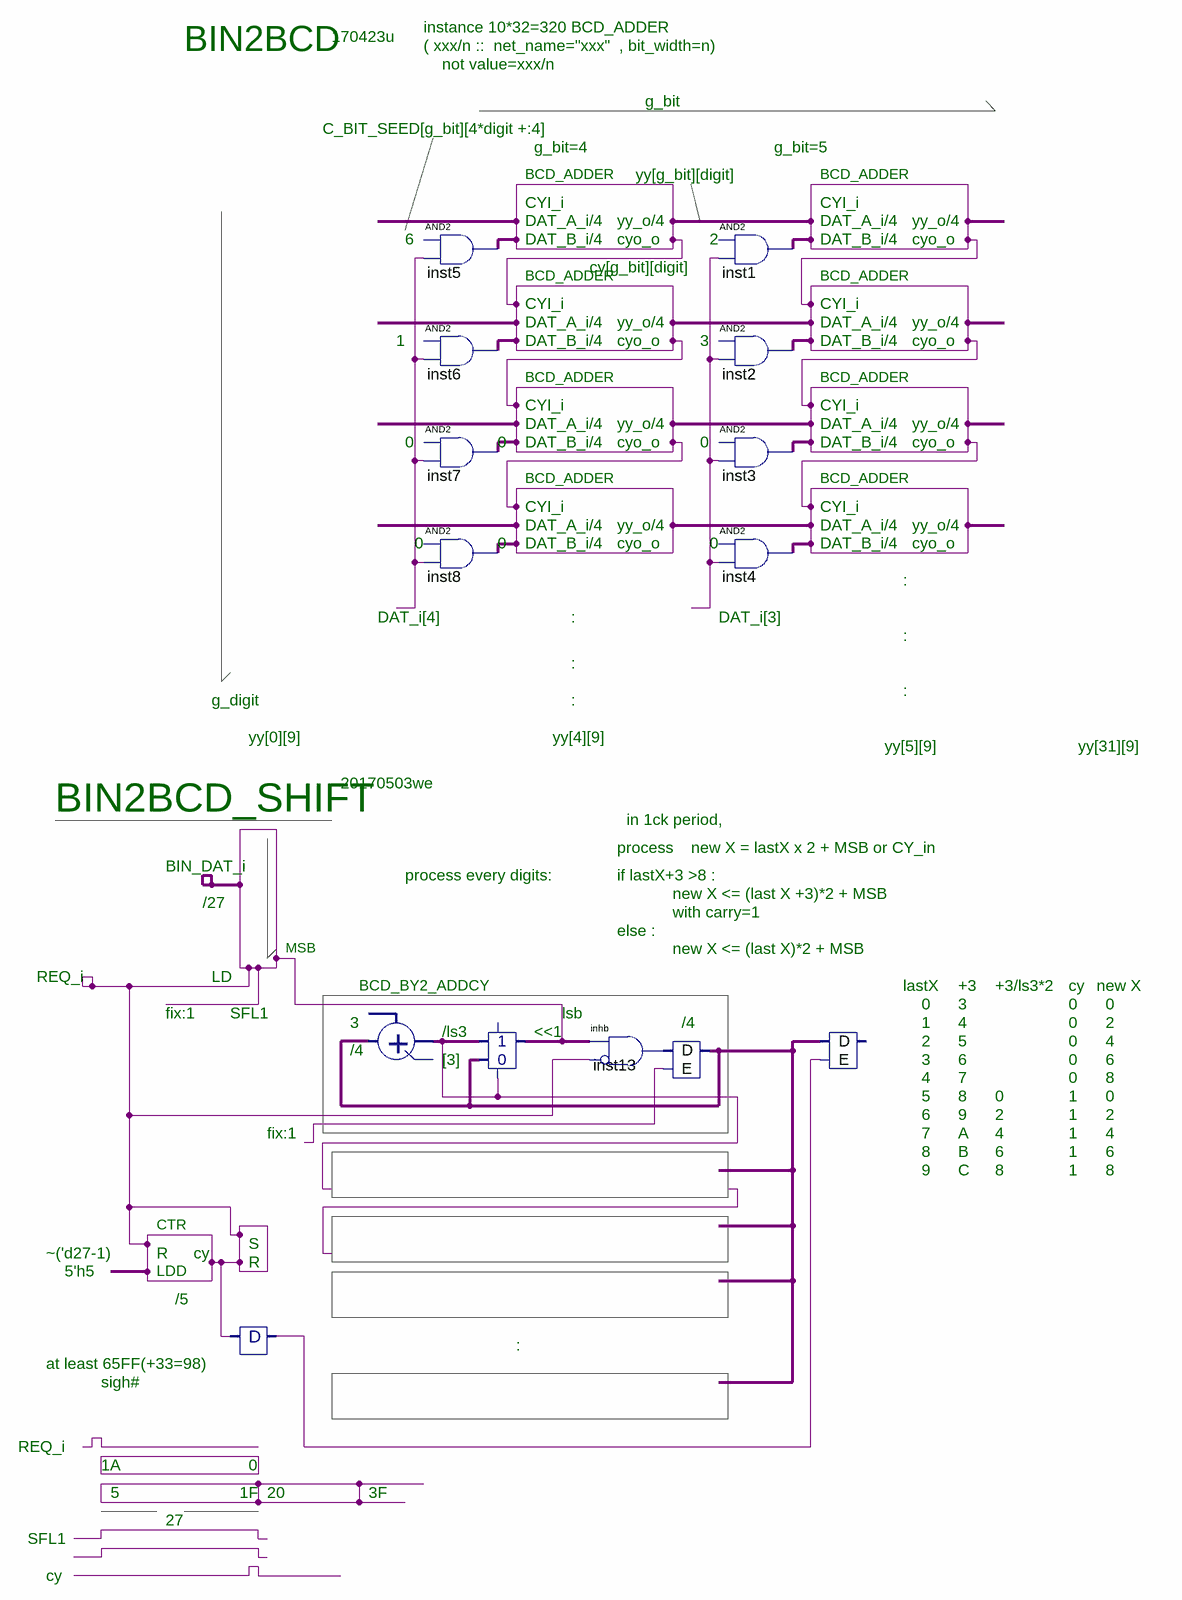
[diagram p0: schematic sheet]
// Quartus schematic BIN2BCD.bdf as structural Verilog: 14 symbols, 0 pins
module BIN2BCD (
);

  wire inst5_out, inst13_1, inst17_y, inst_y, undriven, undriven_2, undriven_3, undriven_4;
  wire [7:0] inst11_y, inst12_y;

  D inst17 (.A({8{inst_y}}), .Y(inst17_y));
  buf inst5 (inst5_out, undriven);  // AND2 open: IN1
  buf inst6 (inst5_out, undriven);  // AND2 open: IN1
  buf inst7 (inst5_out, undriven);  // AND2 open: IN1
  buf inst8 (inst5_out, undriven);  // AND2 open: IN1
  add inst12 (.A(inst11_y), .Y(inst12_y));  // open: B, cy
  \2_1sel  inst (.A(inst12_y), .B(inst11_y), .S1(undriven_4), .Y(inst_y));  // open: S0
  inhb inst13 (.\2 (inst_y), .\3 (inst_y), .\1 (inst13_1));
  buf inst1 (inst5_out, undriven_2);  // AND2 open: IN1
  buf inst2 (inst5_out, undriven_2);  // AND2 open: IN1
  buf inst3 (inst5_out, undriven_2);  // AND2 open: IN1
  buf inst4 (inst5_out, undriven_2);  // AND2 open: IN1
  DE inst11 (.D(inst13_1), .E(undriven_3), .Y(inst11_y));
  DE inst14 (.D(inst11_y), .E(inst17_y));  // open: Y

  // Notes on the sheet:
  //   BIN2BCD
  //   instance 10*32=320 BCD_ADDER
  //   170423u
  //   ( xxx/n ::  net_name="xxx"  , bit_width=n)
  //   not value=xxx/n
  //   g_bit
  //   C_BIT_SEED[g_bit][4*digit +:4]
  //   g_bit=4
  //   g_bit=5
  //   BCD_ADDER
  //   yy[g_bit][digit]
  //   BCD_ADDER
  //   CYI_i
  //   CYI_i
  //   DAT_A_i/4
  //   yy_o/4
  //   DAT_A_i/4
  //   yy_o/4
  //   6
  //   DAT_B_i/4
  //   cyo_o
  //   2
  //   DAT_B_i/4
  //   cyo_o
  //   cy[g_bit][digit]
  //   BCD_ADDER
  //   BCD_ADDER
  //   CYI_i
  //   CYI_i
  //   DAT_A_i/4
  //   yy_o/4
  //   DAT_A_i/4
  //   yy_o/4
  //   1
  //   DAT_B_i/4
  //   cyo_o
  //   3
  //   DAT_B_i/4
  //   cyo_o
  //   BCD_ADDER
  //   BCD_ADDER
  //   CYI_i
  //   CYI_i
  //   DAT_A_i/4
  //   yy_o/4
  //   DAT_A_i/4
  //   yy_o/4
  //   0
  //   0
  //   DAT_B_i/4
  //   cyo_o
  //   0
  //   DAT_B_i/4
  //   cyo_o
  //   BCD_ADDER
  //   BCD_ADDER
  //   CYI_i
  //   CYI_i
  //   DAT_A_i/4
  //   yy_o/4
  //   DAT_A_i/4
  //   yy_o/4
  //   0
  //   0
  //   DAT_B_i/4
  //   cyo_o
  //   0
  //   DAT_B_i/4
  //   cyo_o
  //   :
  //   DAT_i[4]
  //   :
  //   DAT_i[3]
  //   :
  //   :
  //   :
  //   g_digit
  //   :
  //   yy[0][9]
  //   yy[4][9]
  //   yy[5][9]
  //   yy[31][9]
  //   BIN2BCD_SHIFT
  //   20170503we
  //   in 1ck period,
  //   process
  //   new X = lastX x 2 + MSB or CY_in
  //   BIN_DAT_i
  //   process every digits:
  //   if lastX+3 >8 :
  //   new X <= (last X +3)*2 + MSB
  //   /27
  //   with carry=1
  //   else :
  //   MSB
  //   new X <= (last X)*2 + MSB
  //   REQ_i
  //   LD
  //   BCD_BY2_ADDCY
  //   lastX
  //   +3
  //   +3/ls3*2
  //   cy
  //   new X
  //   0
  //   3
  //   0
  //   0
  //   fix:1
  //   SFL1
  //   lsb
  //   3
  //   /4
  //   1
  //   4
  //   0
  //   2
  //   /ls3
  //   <<1
  //   2
  //   5
  //   0
  //   4
  //   /4
  //   [3]
  //   3
  //   6
  //   0
  //   6
  //   4
  //   7
  //   0
  //   8
  //   5
  //   8
  //   0
  //   1
  //   0
  //   6
  //   9
  //   2
  //   1
  //   2
  //   fix:1
  //   7
  //   A
  //   4
  //   1
  //   4
  //   8
  //   B
  //   6
  //   1
  //   6
  //   9
  //   C
  //   8
  //   1
  //   8
  //   CTR
  //   S
  //   ~('d27-1)
  //   R
  //   cy
  //   R
  //   5'h5
  //   LDD
  //   /5
  //   :
  //   at least 65FF(+33=98)
  //   sigh#
  //   REQ_i
  //   1A
  //   0
  //   5
  //   1F
  //   20
  //   3F
  //   27
  //   SFL1
  //   cy
endmodule
